# Altium project 霍尔传感器.PrjPcb
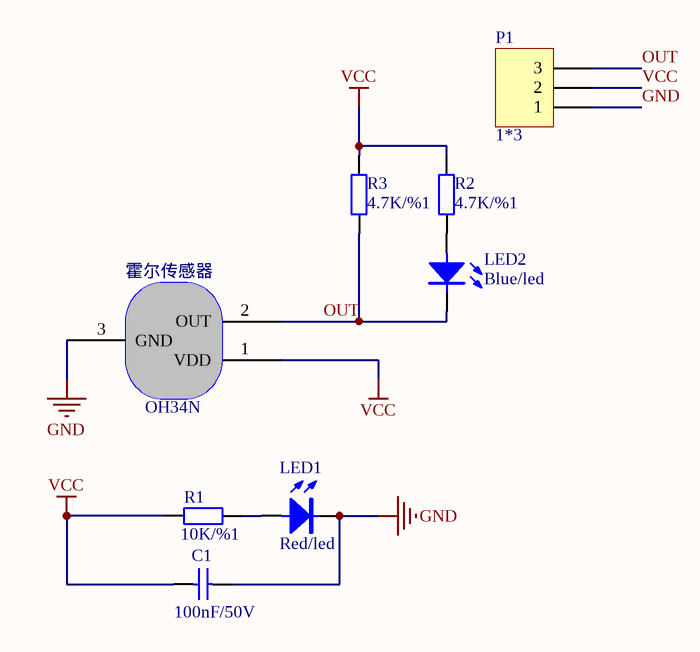
[diagram p0: oh34n.SchDoc]
1 sheet, 8 parts. Net scope: global (net labels, ports and power ports of the same name join across sheets).
Board file: 34.PcbDoc

## Sheet oh34n.SchDoc
size A4

### Parts
C1  100nF/50V  [0805]
LED1  Red/led  [LED-0805]
LED2  Blue/led  [LED-0805]
P1  1*3  [HDR1X3]
R1  10K/%1  [0805]
R2  4.7K/%1  [0805]
R3  4.7K/%1  [0805]
霍尔传感器  oh34n  [SOT23-3L]  (value not drawn)

### Nets
GND: C1.2 LED1.2(C) P1.1 霍尔传感器.3(GND)
VCC: C1.1 P1.2 R1.1 R2.2 R3.2 霍尔传感器.1(VDD)
OUT: LED2.2(C) P1.3 R3.1 霍尔传感器.2(OUT)
NetLED1_1: LED1.1(A) R1.2
NetLED2_1: LED2.1(A) R2.1

### Notes on the sheet
- (in symbol Component_1) OH34N

### Library data of the parts
C1 = Cap: Capacitor; Published: 8-Jun-2000; LatestRevisionDate: 17-Jul-2002; LatestRevisionNote: Re-released for DXP Platform.; PackageReference: RAD-0.3; Publisher: Altium Limited
LED1 LED2 = LED
P1 = Header 3: Header, 3-Pin; LatestRevisionDate: 17-Jul-2002; LatestRevisionNote: Re-released for DXP Platform.; Publisher: Altium Limited
R1-R3 = Res2: Resistor; Published: 8-Jun-2000; LatestRevisionDate: 17-Jul-2002; LatestRevisionNote: Re-released for DXP Platform.; PackageReference: AXIAL-0.4; Publisher: Altium Limited
霍尔传感器 = Component_1